# EAGLE schematic FM-Super-Regenerative-Tuner-ForcedQuench (EAGLE 7.2.0)
Forced quenching improves three-transistor FM tuner Lyle Williams -February 29, 2016 http://www.edn.com/design/diy/4441531/Forced-quenching-improves-three-transistor-FM-tuner
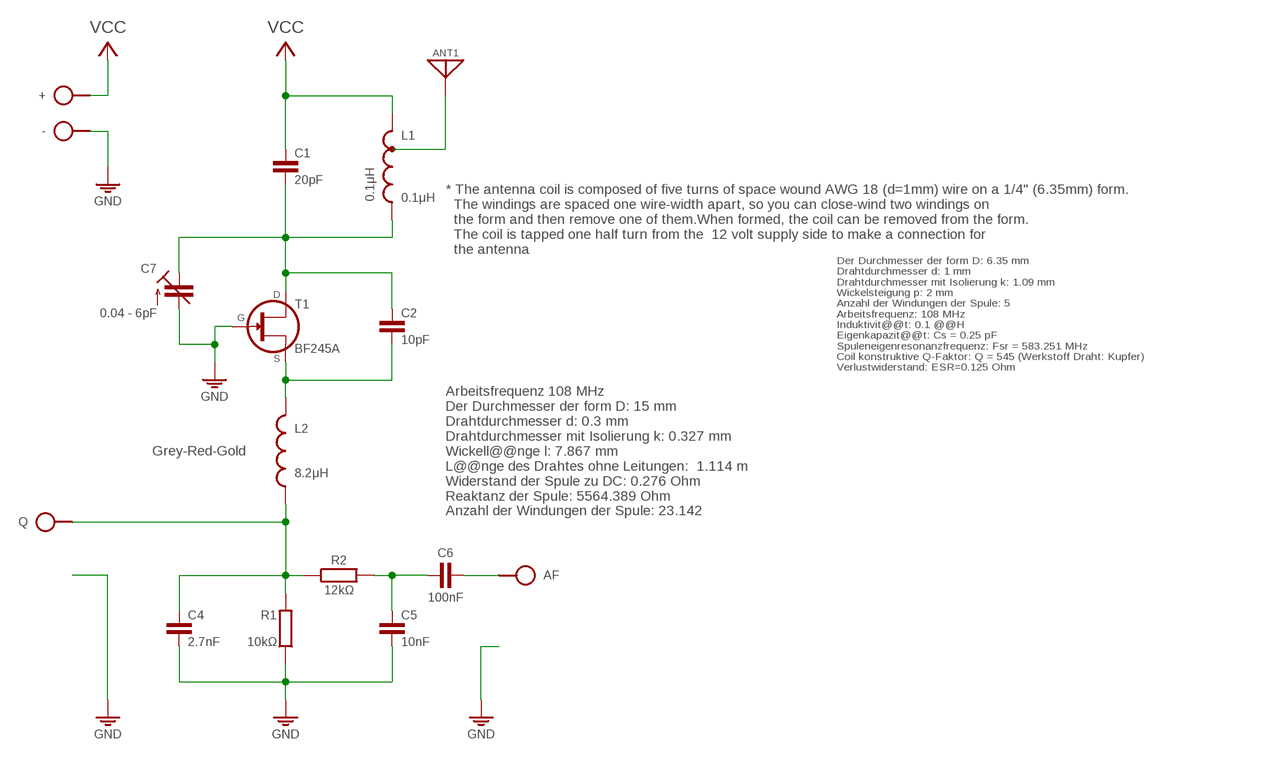
[diagram p0: schematic, sheet 1]

## Parts
+  SPAD  [SPAD]
-  SPAD  [SPAD]
AF  SPAD  [SPAD]
ANT1  ANT  [SPAD]
C1  20pF  C025-015X024  [C025-015X024]
C2  10pF  C025-015X024  [C025-015X024]
C4  2.7nF  C050-020X044  [C050-020X044]
C5  10nF  C025-015X024  [C025-015X024]
C6  100nF  C-H050-020X044  [C050-020X044]
C7  0.04 - 6pF  C-TR-PH20127-TZ03  [CTRIMTZ03]
L1  0.1μH  L-TAP1L-08-7/5H  [L-08-7/8-TAP1]
L2  8.2μH  L04/7-V  [L-04/7-V]
Q  SPAD  [SPAD]
R1  10kΩ  R0204/7  [0204/7]
R2  12kΩ  R-H0204/7  [0204/7]
T1  BF245A  BF245BTO92  [TO92-GSD]

## Nets
GND: -.1 C4.2 C5.2 C7.1(A) R1.1 T1.1(G)
N$1: C1.2 C2.1 C7.2(E) L1.2 T1.3(D)
N$2: C4.1 L2.2 Q.1 R1.2 R2.1
N$4: ANT1.1 L1.3(T)
N$5: C2.2 L2.1 T1.2(S)
N$6: C5.1 C6.1 R2.2
N$8: AF.1 C6.2
VCC: +.1 C1.1 L1.1

## Notes on the sheet
- * The antenna coil is composed of five turns of space wound AWG 18 (d=1mm) wire on a 1/4" (6.35mm) form.
    The windings are spaced one wire-width apart, so you can close-wind two windings on
    the form and then remove one of them.When formed, the coil can be removed from the form.
    The coil is tapped one half turn from the  12 volt supply side to make a connection for
    the antenna
- Der Durchmesser der form D: 6.35 mm
  Drahtdurchmesser d: 1 mm
  Drahtdurchmesser mit Isolierung k: 1.09 mm
  Wickelsteigung p: 2 mm
  Anzahl der Windungen der Spule: 5
  Arbeitsfrequenz: 108 MHz
  Induktivit@@t: 0.1 @@H
  Eigenkapazit@@t: Cs = 0.25 pF
  Spuleneigenresonanzfrequenz: Fsr = 583.251 MHz
  Coil konstruktive Q-Faktor: Q = 545 (Werkstoff Draht: Kupfer)
  Verlustwiderstand: ESR=0.125 Ohm
- Grey-Red-Gold
- Arbeitsfrequenz 108 MHz
  Der Durchmesser der form D: 15 mm
  Drahtdurchmesser d: 0.3 mm
  Drahtdurchmesser mit Isolierung k: 0.327 mm
  Wickell@@nge l: 7.867 mm
  L@@nge des Drahtes ohne Leitungen:  1.114 m
  Widerstand der Spule zu DC: 0.276 Ohm
  Reaktanz der Spule: 5564.389 Ohm
  Anzahl der Windungen der Spule: 23.142

## Library data of the parts
+ - AF Q = pad:SPAD
ANT1 = pad:ANT
C1 C2 C4 C5 = c:C: CAPACITOR, European symbol
C6 = c:C-H
C7 = cap-trim:C-TR-PH20127
L1 = l:L-TAP1
L2 = l:L: Potentiometers Beckman, Copal, Piher, Spectrol, Schukat Created by librarian@cadsoft.de
R1 = r:R: RESISTOR, European symbol
R2 = r:R-H
T1 = t:BF245B: Transistors

## Net classes
0 default: width 0.61 mm